# Altium project PCB_Project.PrjPcb
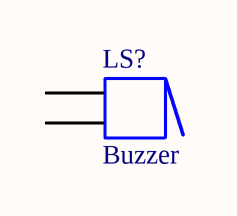
[diagram p0: PCI short card 5V - 64 BIT.schdoc]
1 sheet, 1 parts. Net scope: global (net labels, ports and power ports of the same name join across sheets).
Board file: PCI short card 5V - 64 BIT.PCBDOC

## Sheet PCI short card 5V - 64 BIT.schdoc: PCI short card 5V - 64 BIT
size 100 x 100 mm; Organization: Organization; Address1: Address1; Address2: Address2; Address3: Address3; Address4: Address4; DocumentNumber: 1; Revision: 0; SheetNumber: 2; SheetTotal: 2

### Parts
LS?  Buzzer  [ABSM-1574]

### Nets
NetLS?_1: LS?.1 LS?.1A
NetLS?_2: LS?.2 LS?.2A

### Library data of the parts
LS? = Buzzer: Magnetic Transducer Buzzer; Published: 24-Mar-1999; LatestRevisionDate: 17-Dec-2003; LatestRevisionNote: Schematic revised, PCB Footprint replaced.; DatasheetVersion: 17-Dec-2003; PackageReference: ABSM-1574; Publisher: Altium Limited; PackageDescription: Magnetic Transducer Buzzer; ComponentLink1Description: Manufacturer Link; ComponentLink1URL: http://www.megastar.com/linecard/buzzmode/index.php